# EAGLE design prometeo_001 (EAGLE 7.6.0)
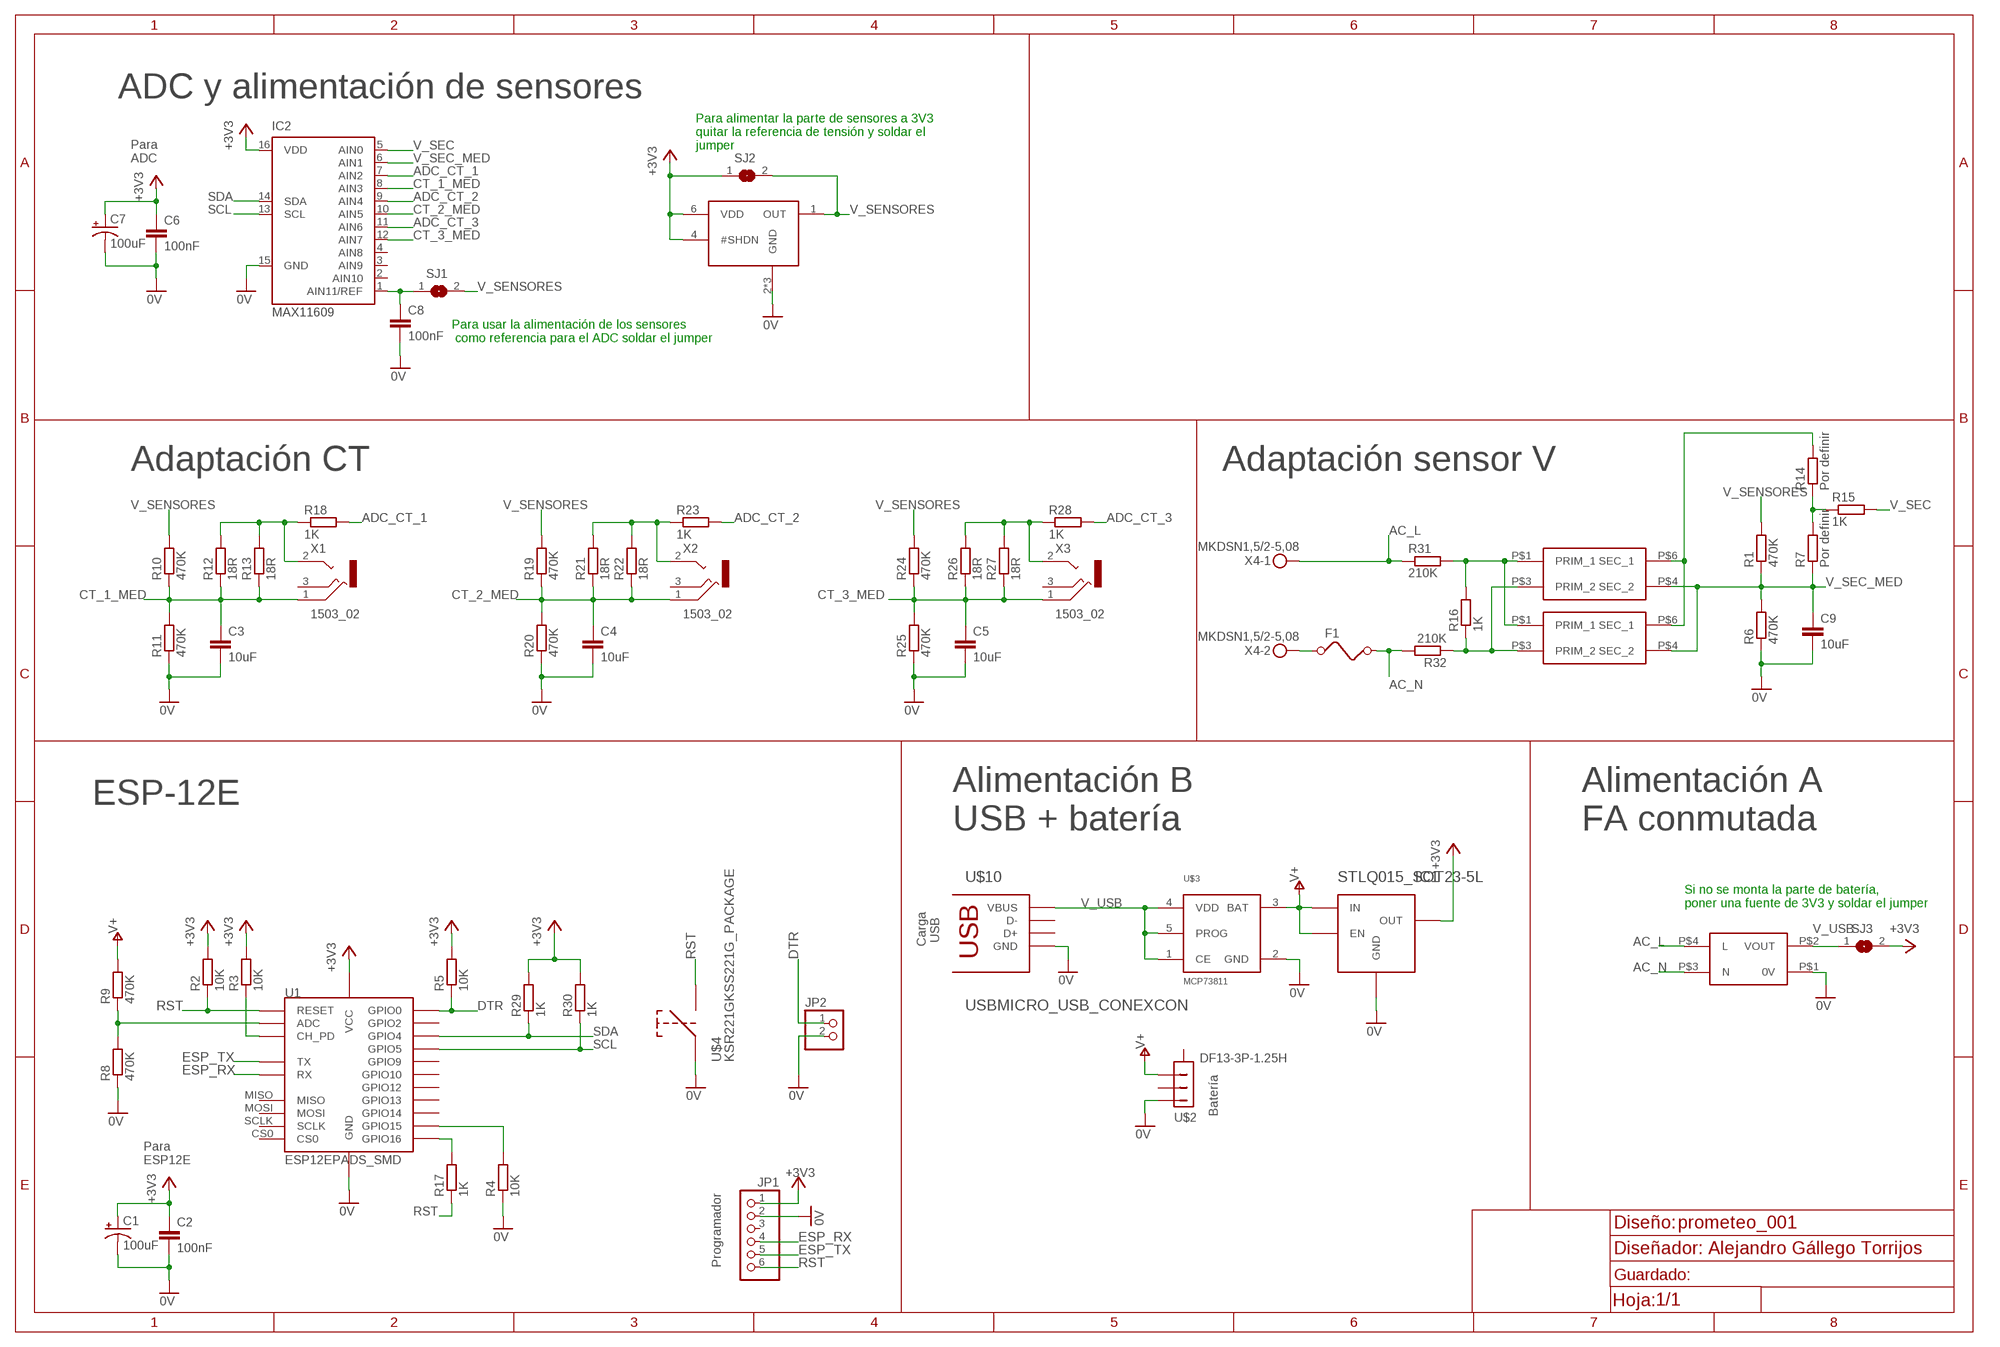
[diagram p0: schematic, sheet 1]

## Parts
C1  100uF  CPOL-USSMCC  [SMC_C]
C2  100nF  C-EUC0402  [C0402]
C3  10uF  C-EUC0805  [C0805]
C4  10uF  C-EUC0805  [C0805]
C5  10uF  C-EUC0805  [C0805]
C6  100nF  C-EUC0402  [C0402]
C7  100uF  CPOL-USSMCC  [SMC_C]
C8  100nF  C-EUC0402  [C0402]
C9  10uF  C-EUC0805  [C0805]
F1  FUSE  [FUSE]
IC1  STLQ015_SOT23-5L  [SOT23-5L]
IC2  MAX11609  [QSOP16]
JP1  PINHD-1X06_2.00  [1X06M]
JP2  PINHD-1X2  [1X02]
R1  470K  R-EU_R0402  [R0402]
R2  10K  R-EU_R0402  [R0402]
R3  10K  R-EU_R0402  [R0402]
R4  10K  R-EU_R0402  [R0402]
R5  10K  R-EU_R0402  [R0402]
R6  470K  R-EU_R0402  [R0402]
R7  Por definir  R-EU_R0402  [R0402]
R8  470K  R-EU_R0402  [R0402]
R9  470K  R-EU_R0402  [R0402]
R10  470K  R-EU_R0402  [R0402]
R11  470K  R-EU_R0402  [R0402]
R12  18R  R-EU_R1206  [R1206]
R13  18R  R-EU_0204/7  [0204/7]
R14  Por definir  R-EU_R0402  [R0402]
R15  1K  R-EU_R0402  [R0402]
R16  1K  R-EU_R1206  [R1206]
R17  1K  R-EU_R0402  [R0402]
R18  1K  R-EU_R0402  [R0402]
R19  470K  R-EU_R0402  [R0402]
R20  470K  R-EU_R0402  [R0402]
R21  18R  R-EU_R1206  [R1206]
R22  18R  R-EU_0204/7  [0204/7]
R23  1K  R-EU_R0402  [R0402]
R24  470K  R-EU_R0402  [R0402]
R25  470K  R-EU_R0402  [R0402]
R26  18R  R-EU_R1206  [R1206]
R27  18R  R-EU_0204/7  [0204/7]
R28  1K  R-EU_R0402  [R0402]
R29  1K  R-EU_R0402  [R0402]
R30  1K  R-EU_R0402  [R0402]
R31  210K  R-EU_R1206  [R1206]
R32  210K  R-EU_R1206  [R1206]
SJ1  SJ  [SJ]
SJ2  SJ  [SJ]
SJ3  SJ  [SJ]
U1  ESP12EPADS_SMD  [ESP12E_SMD]
U$1  MCP1501  [SOT23-6]
U$2  DF13-3P-1.25H  [DF13A-3P-1.25H]
U$3  MCP73811  [SOT23-5L]
U$4  KSR221GKSS221G_PACKAGE  [SMD1]
U$5  PSU_VTX  [PSU_VTX]
U$6  TRAFO_AISLAMIENTOBOURNS_SM-LP-5001  [SM-LP-5001]
U$7  TRAFO_AISLAMIENTOETAL_P3191  [P3191]
U$10  USBMICRO_USB_CONEXCON  [MICROUSB_CONEXCON_5632]
X1  1503_02  [1503_02]
X2  1503_02  [1503_02]
X3  1503_02  [1503_02]
X4  MKDSN1,5/2-5,08  [MKDSN1,5/2-5,08]

## Nets
0V: C1.- C2.2 C3.2 C4.2 C5.2 C6.2 C7.- C8.2 C9.2 IC1.2(GND) IC2.15(GND) JP1.2 JP2.2 R4.1 R6.1 R8.1 R11.1 R20.1 R25.1 U1.GND U$1.2(GND) U$1.3(GND) U$1.5(GND) U$2.P$1 U$3.2(GND) U$4.P$1 U$5.P$1(0V) U$10.GND U$10.GND1(GND) U$10.GND2(GND) U$10.P$8(GND) U$10.P$9(GND)
+3V3: C1.+ C2.1 C6.1 C7.+ IC1.5(OUT) IC2.16(VDD) JP1.1 R2.2 R3.2 R5.2 R29.2 R30.2 SJ2.1 SJ3.2 U1.VCC U$1.4(#SHDN) U$1.6(VDD)
AC_L: R31.1 U$5.P$4(L) X4.1
AC_N: F1.2 R32.2 U$5.P$3(N)
ADC_CT_1: IC2.7(AIN2) R18.2
ADC_CT_2: IC2.9(AIN4) R23.2
ADC_CT_3: IC2.11(AIN6) R28.2
CT_1_MED: C3.1 IC2.8(AIN3) R10.1 R11.2 R12.1 R13.1 X1.1
CT_2_MED: C4.1 IC2.10(AIN5) R19.1 R20.2 R21.1 R22.1 X2.1
CT_3_MED: C5.1 IC2.12(AIN7) R24.1 R25.2 R26.1 R27.1 X3.1
DTR: JP2.1 R5.1 U1.GPIO0
ESP_RX: JP1.4 U1.RXD(RX)
ESP_TX: JP1.5 U1.TXD(TX)
N$1: R4.2 U1.GPIO15
N$2: R16.2 R31.2 U$6.P$1(PRIM_1) U$7.P$1(PRIM_1)
N$3: R3.1 U1.CH-PD(CH_PD)
N$4: R16.1 R32.1 U$6.P$3(PRIM_2) U$7.P$3(PRIM_2)
N$5: R14.2 U$6.P$6(SEC_1) U$7.P$6(SEC_1)
N$6: F1.1 X4.2
N$7: R7.2 R14.1 R15.1
N$10: R8.2 R9.1 U1.ADC
N$13: R12.2 R13.2 R18.1 X1.2
N$16: R17.2 U1.GPIO16
N$18: R21.2 R22.2 R23.1 X2.2
N$21: R26.2 R27.2 R28.1 X3.2
N$25: C8.1 IC2.1(AIN11/REF) SJ1.1
RST: JP1.6 R2.1 R17.1 U1.RST(RESET) U$4.P$2
SCL: IC2.13(SCL) R30.1 U1.GPIO5
SDA: IC2.14(SDA) R29.1 U1.GPIO4
V+: IC1.1(IN) IC1.3(EN) R9.2 U$2.P$3 U$3.3(BAT)
V_SEC: IC2.5(AIN0) R15.2
V_SEC_MED: C9.1 IC2.6(AIN1) R1.1 R6.2 R7.1 U$6.P$4(SEC_2) U$7.P$4(SEC_2)
V_SENSORES: R1.2 R10.2 R19.2 R24.2 SJ1.2 SJ2.2 U$1.1(OUT)
V_USB: SJ3.1 U$3.1(CE) U$3.4(VDD) U$3.5(PROG) U$5.P$2(VOUT) U$10.VBUS
Unconnected: IC2.2(AIN10) IC2.3(AIN9) IC2.4(AIN8) JP1.3 U1.CS0 U1.GPIO2 U1.GPIO9 U1.GPIO10 U1.GPIO12 U1.GPIO13 U1.GPIO14 U1.MISO U1.MOSI U1.SCLK U$2.M$0 U$2.M$1 U$2.P$2 U$10.D+ U$10.D- X1.2@2 X1.3 X2.2@2 X2.3 X3.2@2 X3.3

## Notes on the sheet
- ADC y alimentación de sensores
- Para alimentar la parte de sensores a 3V3 
  quitar la referencia de tensión y soldar el 
  jumper
- Para 
  ADC
- Para usar la alimentación de los sensores
   como referencia para el ADC soldar el jumper
- Adaptación CT | Adaptación sensor V
- ESP-12E
- Alimentación B
  USB + batería
- Alimentación A
  FA conmutada
- Si no se monta la parte de batería,
  poner una fuente de 3V3 y soldar el jumper
- Carga
   USB
- Batería
- Para 
  ESP12E
- Diseñador: Alejandro Gállego Torrijos
- Programador

## Library data of the parts
C1 C7 = rcl:CPOL-US: POLARIZED CAPACITOR, American symbol
C2-C6 C8 C9 = rcl:C-EU: CAPACITOR, European symbol
F1 = special:FUSE: FUSE 5 x 20 mm
IC1 = libelium:STLQ015: ST => STLQ015XG33R
IC2 = libelium:MAX11609: 2.7V to 5.5V, Low-Power, 4-/12-Channel 2-Wire Serial 8-Bit ADCs Source: http://datasheets.maxim-ic.com/en/ds/MAX1036-MAX1039M.pdf
JP1 = pinhead-2:PINHD-1X06: PIN HEADER
JP2 = pinhead:PINHD-1X2: PIN HEADER
R1-R32 = rcl:R-EU_: RESISTOR, European symbol
SJ1-SJ3 = jumper:SJ: SMD solder JUMPER
U1 = esp8266modules:ESP12E
U$1 = libelium:MCP1501
U$2 = libelium:DF13-3P-1.25: DF13-3P 1.25mm Pitch Miniature Crimping Connector.; MF: Hirose; MPN: DF13-3P-1.25H
U$3 = libelium:MCP73811
U$4 = libelium:KSR221G; MF: C&K Components; MPN: KSR221G LFS; OC_FARNELL: 1201421
U$5 = libelium:PSU_VTX
U$6 U$7 = libelium:TRAFO_AISLAMIENTO
U$10 = libelium:USB: Conexcon => 5632-16052E; MF: Conexcon; MPN: 5632-16052E
X1-X3 = con-lumberg:1503_02: Jack connectors according to JISC 6560, 3.5 mm Klinkeneinbaukupplung nach JISC 6560, 3,5 mm, 3-polig/stereo, abgewinkelte Ausführung, Surface-Mount-Technik (SMT) Source: http://www.lumberg.com/Produkte/PDFs/1503_02.pdf; OC_FARNELL: 1216979; OC_NEWARK: unknown
X4 = con-phoenix-508:MKDSN1,5/2-5,08: MKDSN 1,5/ 2-5,08 Printklemme Nennstrom: 13,5 A Nennspannung: 250 V Rastermaß: 5,08 mm Polzahl: 2 Anschlussart: Schraubanschluss Montage: Löten Anschlussrichtung Leiter/Platine: 0 ° Artikelnummer: 1729128 Source: http://eshop.phoenixcontact.com .. 1729128.pdf

## Board
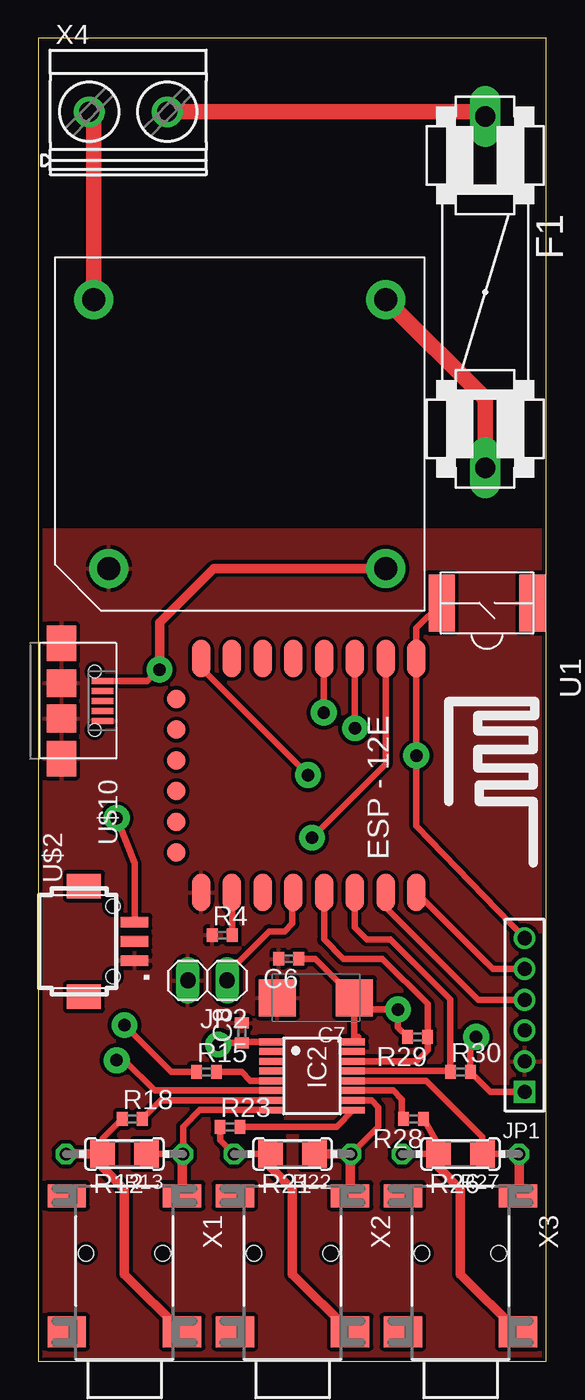
[diagram p1: board, top side]
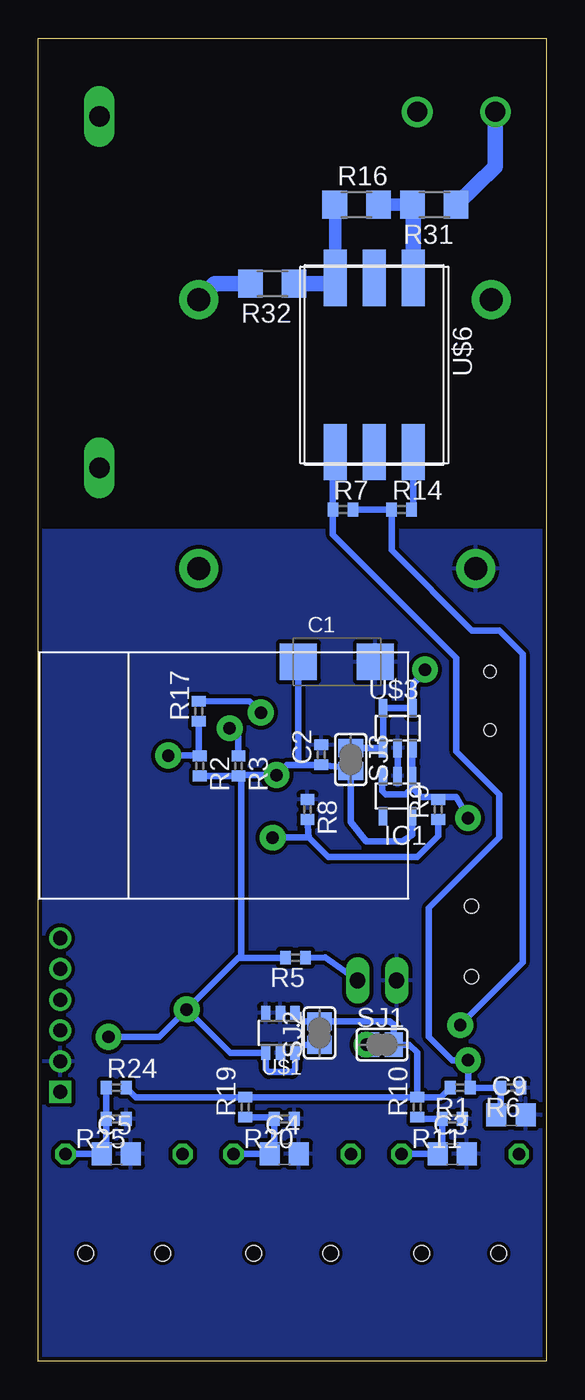
[diagram p2: board, bottom side, seen from below]

Size 33 x 86 mm. Coordinates in mm from the lower left corner, seen from the top.
Outline: 0,0 33,0 33,86 0,86 0,0
Copper layers (1*16): Top 0.035mm / dielectric 1.5mm / Bottom 0.035mm
Design rules "SeeedStudio_2layer_DRU_no_angle_20140221": minimum track width 6mil, minimum drill 12mil, track to track 6mil, track to pad 6mil, pad to pad 6mil, via to via 6mil, smd to smd 0mil, copper to edge 10mil, drill to drill 10mil, minimum pad ring 10mil, minimum via ring 6mil, stop-mask expansion 2mil, vias tented up to drill 100mil, thermal gap 10mil

### Footprints (pad centres in the part's own frame; a part is rotated, then mirrored left to right if it is on the bottom)
SMC_C = smd 2.4 x 2.4: + -2.5,0; - 2.5,0
C0402 = smd 0.7 x 0.9: 1 -0.65,0; 2 0.65,0
C0805 = smd 1.3 x 1.5: 1 -0.95,0; 2 0.95,0
FUSE = drill 1.321 long: 1 -11.43,0; 2 11.43,0
SOT23-5L = smd 0.55 x 1.2: 1 -0.95,-1.3; 2 0,-1.3; 3 0.95,-1.3; 4 0.95,1.3; 5 -0.95,1.3
QSOP16 = smd 0.45 x 1.5: 1 -2.223,-2.69; 2 -1.587,-2.69; 3 -0.953,-2.69; 4 -0.318,-2.69; 5 0.318,-2.69; 6 0.953,-2.69; 7 1.587,-2.69; 8 2.223,-2.69; 9 2.223,2.69; 10 1.587,2.69; 11 0.953,2.69; 12 0.318,2.69; 13 -0.318,2.69; 14 -0.953,2.69; 15 -1.587,2.69; 16 -2.223,2.69
1X06M = drill 0.914 square: 1 -5,0 | drill 0.914: 2 -3,0; 3 -1,0; 4 1,0; 5 3,0; 6 5,0
1X02 = drill 1.016 long: 1 -1.27,0; 2 1.27,0
R0402 = smd 0.7 x 0.9: 1 -0.65,0; 2 0.65,0
R1206 = smd 1.6 x 1.803: 1 -1.422,0; 2 1.422,0
0204/7 = drill 0.813 octagon: 1 -3.81,0; 2 3.81,0
SJ = smd 1.168 x 1.6: 1 -0.762,0; 2 0.762,0
ESP12E_SMD = smd 2.413 x 1.194: ADC -7.239,4.706; CH-PD -7.239,2.706; GND 7.976,-7.294; GPIO0 7.976,-1.294; GPIO2 7.976,-3.294; GPIO4 7.976,0.706; GPIO5 7.976,2.706; GPIO12 -7.239,-3.294; GPIO13 -7.239,-5.294; GPIO14 -7.239,-1.294; GPIO15 7.976,-5.294; GPIO16 -7.239,0.706; RST -7.239,6.706; RXD 7.976,4.706; TXD 7.976,6.706; VCC -7.239,-7.294 | smd 1.194 x 1.194: CS0 -4.615,-8.89; GPIO9 -0.615,-8.89; GPIO10 1.385,-8.89; MISO -2.615,-8.89; MOSI 3.385,-8.89; SCLK 5.385,-8.89
SOT23-6 = smd 0.6 x 0.9: 1 -0.95,-1.3; 2 0,-1.3; 3 0.95,-1.3; 4 0.95,1.3; 5 0,1.3; 6 -0.95,1.3
DF13A-3P-1.25H = smd 1.6 x 2.2: M$0 -3.6,2.4; M$1 3.6,2.4 | smd 0.7 x 1.8: P$1 -1.25,-0.9; P$2 0,-0.9; P$3 1.25,-0.9 | hole 0.9: 2.3,0.5; -2.3,0.5
SMD1 = smd 1.7 x 3.7: P$1 2.95,0; P$2 -2.95,0
PSU_VTX = drill 1.5 pad 2.54: P$1 8.75,-8.5; P$2 8.75,9.5; P$3 -8.75,9.5; P$4 -8.75,-9.5
SM-LP-5001 = smd 2.5 x 1.5: P$1 -6.25,2.54; P$2 -6.25,0; P$3 -6.25,-2.54; P$4 6.25,-2.54; P$5 6.25,0; P$6 6.25,2.54
P3191 = smd 2.5 x 1.5: P$1 -5.08,2.54; P$2 -5.08,0; P$3 -5.08,-2.54; P$4 5.08,-2.54; P$5 5.08,0; P$6 5.08,2.54
MICROUSB_CONEXCON_5632 = smd 0.4 x 1.4: D+ 0,4.1; D- -0.65,4.1; GND 1.3,4.1; P$6 0.65,4.1; VBUS -1.3,4.1 | smd 2.3 x 1.9: GND1 -3.75,1.45; GND2 3.75,1.45 | smd 1.8 x 1.9: P$8 -1.15,1.45; P$9 1.15,1.45 | hole 0.8: -1.9,3.6; 1.9,3.6
1503_02 = smd 2.5 x 1.5: 1 -3.75,-10.75; 3 3.75,-10.75 | smd 2.5 x 2: 2 -3.75,-1.9; 2@2 3.75,-1.9 | hole 1: -2.5,-7; 2.5,-7
MKDSN1,5/2-5,08 = drill 1.3 pad 2: 1 -2.561,0.025; 2 2.519,0.025

### Placement (x,y rotation side)
C1  13.6,45.47 0 bottom
C2  14.63,39.42 90 bottom
C3  6.1,13.46 0 bottom
C4  17.02,13.46 0 bottom
C5  27.94,13.46 0 bottom
C6  16.27,26.16 180 top
C7  18.03,23.62 180 top
C8  13.21,21.34 90 top
C9  2.29,16 0 bottom
F1  29.04,69.5 270 top
IC1  9.66,36.74 180 bottom
IC2  17.78,18.54 270 top
JP1  31.6,22.5 90 top
JP2  10.99,24.75 180 top
R1  5.59,17.78 180 bottom
R2  22.51,38.7 270 bottom
R3  20,38.7 270 bottom
R4  11.94,27.69 0 top
R5  16.29,26.23 180 bottom
R6  2.29,17.78 180 bottom
R7  13.21,55.37 0 bottom
R8  15.52,35.86 270 bottom
R9  7.01,35.86 90 bottom
R10  8.38,16.51 90 bottom
R11  6.1,15.75 180 bottom
R12  5.59,13.46 180 top
R13  5.59,13.46 180 top
R14  9.4,55.37 0 bottom
R15  10.92,18.8 0 top
R16  12.32,75.18 0 bottom
R17  22.57,42.25 90 bottom
R18  6.1,15.75 0 top
R19  19.56,16.51 90 bottom
R20  17.02,15.75 180 bottom
R21  16.51,13.46 180 top
R22  16.51,13.46 180 top
R23  12.45,15.24 0 top
R24  27.94,17.78 0 bottom
R25  27.94,15.75 180 bottom
R26  27.43,13.46 180 top
R27  27.43,13.46 180 top
R28  24.38,15.75 180 top
R29  24.64,21.08 180 top
R30  27.43,18.8 0 top
R31  7.27,75.18 180 bottom
R32  17.81,70.06 180 bottom
SJ1  10.67,20.57 0 bottom
SJ2  14.73,21.34 90 bottom
SJ3  12.7,39.12 270 bottom
U1  17.86,38.44 270 top
U$1  17.27,21.34 180 bottom
U$2  5.35,27.29 90 top
U$3  9.65,41.15 0 bottom
U$4  29.15,49.3 0 top
U$5  13.08,60.28 270 top
U$6  11.18,64.77 270 bottom
U$7  11.18,64.77 270 bottom
U$10  0.05,42.93 270 top
X1  5.59,0 180 top
X2  16.51,0 180 top
X3  27.43,0 180 top
X4  5.86,81.2 0 top

### Tracks (layer width: path | path; a pad name or v marks a point on that pad's centre or on a via)
0V
  Bottom 0.406: U$3.2 IC1.2
  pour Bottom (isolate 0.254): 0,0 33,0 33,54 0,54
  pour Top (isolate 0.254): 0,0 33,0 33,54 0,54
+3V3  (via drill 0.8 pad 1.68)
  Top 0.406: C7.+ 20.53,20.83 IC2.16 20.79,21.08 | C7.+ 21.08,22.86 v23.37,22.86 23.37,21.7 R29.2 | v28.45,21.08 28.08,20.72 R30.2 29.38,17.5 JP1.1 | C6.1 17.99,26.16 C7.+ | U1.VCC 10.57,45.06 v17.53,38.1
  Bottom 0.406: SJ2.1 15.78,20.57 U$1.6 16.32,18.98 16.51,18.8 18.03,18.8 18.22,18.98 U$1.4 20.54,20.04 v23.37,22.86 | v28.45,21.08 25.15,21.08 v23.37,22.86 | R5.2 19.81,26.23 | 19.81,26.23 20,26.23 v23.37,22.86 | R2.2 R3.2 | R3.2 19.81,37.86 19.81,26.23 | v17.53,38.1 19.95,38.1 R3.2 | IC1.5 8.71,34.22 9.4,33.78 11.68,33.78 12.7,35.05 SJ3.2 13.19,38.61 C2.1 16,38.77 | 17.02,38.61 v17.53,38.1 | 16,38.77 16.86,38.77 v17.53,38.1 | C1.+ 16.1,38.87 16,38.77
AC_L
  Top 1.016: X4.1 3.58,81.22 U$5.P$4
  Bottom 1.016: R31.1 3.3,77.67 X4.1
AC_N
  Top 1.016: F1.2 29.04,62.57 U$5.P$3
  Bottom 1.016: R32.2 21.55,70.06 U$5.P$3
ADC_CT_1
  Top 0.406: IC2.7 7.95,16.95 R18.2
ADC_CT_2
  Top 0.406: R23.2 19.39,15.24 IC2.9
ADC_CT_3
  Top 0.406: IC2.11 23.05,17.59 23.62,17.02 23.62,15.86 R28.2
CT_1_MED
  Top 0.406: R12.1 R13.1 9.4,15.24 10.48,16.32 IC2.8
  Top 0.61: R13.1 9.34,13.46 X1.1
  Bottom 0.406: R13.1 C3.1 6.75,13.76 R11.2 8.27,15.75 R10.1
CT_2_MED
  Top 0.406: IC2.10 21.65,16.95 22.1,16.51 22.1,15.24 R22.1
  Top 0.61: R21.1 R22.1 20.26,13.4 X2.1
  Bottom 0.406: R22.1 C4.1 17.67,13.76 R20.2 17.78,15.86 R19.1
CT_3_MED
  Top 0.406: R27.1 R26.1 28.85,14.58 25.21,18.22 IC2.12
  Top 0.61: R27.1 31.24,10.81 X3.1
  Bottom 0.406: R24.1 R25.2 28.59,13.76 C5.1 R27.1
DTR
  Top 0.406: 16.57,30.63 U1.GPIO0 16.51,30.41 16.51,28.45 16,27.94 14.99,27.94 12.26,25.21 JP2.1
  Bottom 0.406: R5.1 14.36,26.24 JP2.1
ESP_RX
  Top 0.406: U1.RXD 22.57,29.5 28.57,23.5 JP1.4
ESP_TX
  Top 0.406: U1.TXD 29.54,25.5 JP1.5
N$1
  Top 0.406: R4.2 12.59,30.44 U1.GPIO15
N$2
  Bottom 0.813: R31.2 R16.2
  Bottom 1.016: R31.2 8.64,75.06 U$6.P$1 U$7.P$1
N$3  (via drill 0.8 pad 1.68)
  Top 0.406: U1.CH-PD v20.57,41.15
  Bottom 0.406: v20.57,41.15 20,40.57 R3.1
N$4
  Bottom 0.813: R16.1 13.72,75.18 U$7.P$3
  Bottom 1.016: R32.1 13.92,70.06 U$7.P$3 U$6.P$3
N$5
  Bottom 0.406: U$6.P$6 8.64,55.48 R14.2
  Bottom 1.016: U$7.P$6 U$6.P$6
N$6
  Top 1.016: X4.2 29.04,81.22 F1.1
N$7  (via drill 0.8 pad 1.68)
  Top 0.406: R15.1 8.64,18.8 v5.59,21.84
  Bottom 0.406: R7.2 R14.1 10.05,52.72 4.83,47.5 3.05,47.5 1.52,45.97 1.52,25.91 v5.59,21.84
N$10  (via drill 0.8 pad 1.68)
  Top 0.406: U1.ADC 22.57,38.82 v17.78,34.04
  Bottom 0.406: v17.78,34.04 15.42,34.04 | 15.42,34.04 R8.2 | R9.1 7.01,34.14 8.38,32.77 14.15,32.77 15.42,34.04
N$13
  Top 0.406: R12.2 4.17,14.47 R18.1
  Top 0.61: R13.2 R12.2 4.17,12.6 5.59,11.18 5.59,5.65 X1.2
N$16  (via drill 0.8 pad 1.68)
  Top 0.406: U1.GPIO16 18.54,45.66 v18.54,42.16
  Bottom 0.406: v18.54,42.16 19.27,42.89 R17.2
N$18
  Top 0.406: R21.2 R22.2 11.83,14.34 R23.1
  Top 0.61: R21.2 15.09,12.6 16.51,11.18 16.51,5.65 X2.2
N$21
  Top 0.406: R27.2 R26.2 26.01,14.01 R28.1
  Top 0.61: R26.2 26.01,12.6 27.43,11.18 27.43,5.65 X3.2
N$25  (via drill 0.8 pad 1.68)
  Top 0.406: IC2.1 13.29,20.77 C8.1 12.3,20.69 v11.68,20.57
  Bottom 0.406: v11.68,20.57 SJ1.1
RST  (via drill 0.8 pad 1.68)
  Top 0.406: JP1.6 24.57,34.78 v24.57,39.37 U1.RST 24.57,47.66 U$4.P$2
  Bottom 0.406: v24.57,39.37 22.53,39.37 R2.1 22.57,39.41 R17.1
SCL
  Top 0.406: IC2.13 26.72,18.86 R30.1 26.78,23.51 22.86,27.43 21.34,27.43 20.57,28.2 U1.GPIO5
SDA
  Top 0.406: U1.GPIO4 18.57,27.41 19.81,26.16 22.35,26.16 25.29,23.23 R29.1 25.29,20.21 24.57,19.49 IC2.14
V+  (via drill 0.8 pad 1.68)
  Top 0.406: U$2.P$3 6.25,32.36 v5.08,35.31
  Bottom 0.406: U$3.3 IC1.1 8.71,37.26 | 8.71,37.26 9.14,36.83 10.41,36.83 10.67,37.08 10.67,37.98 IC1.3 | R9.2 6.86,36.68 | 6.86,36.68 8.13,36.68 8.71,37.26 | v5.08,35.31 5.84,36.68 6.86,36.68
V_SEC
  Top 0.406: IC2.5 13.78,18.22 13.21,18.8 R15.2
V_SEC_MED  (via drill 0.8 pad 1.68)
  Top 0.406: IC2.6 7.56,17.59 5.59,19.56 v5.08,19.56
  Bottom 0.406: U$6.P$4 13.86,58.38 R7.1 13.86,53.74 5.84,45.72 5.84,39.62 3.05,36.83 3.05,34.04 7.62,29.46 7.62,21.08 6.1,19.56 v5.08,19.56 5.08,17.67 R1.1 R6.2 2.94,16.3 C9.1
  Bottom 1.016: U$7.P$4 U$6.P$4
V_SENSORES
  Bottom 0.406: R10.2 R19.2 26.67,17.16 R24.2 | U$1.1 15.78,22.1 SJ2.2 10.16,22.1 9.91,21.84 SJ1.2 8.89,20.57 8.38,20.07 R10.2 | R1.2 6.86,17.16 R10.2
V_USB  (via drill 0.8 pad 1.68)
  Top 0.406: U$10.VBUS 7.08,44.23 v7.87,44.96
  Top 0.61: U$5.P$2 11.4,51.53 7.87,48.01 v7.87,44.96
  Bottom 0.406: v7.87,44.96 8.64,44.04 U$3.4 U$3.5 U$3.1 12.67,39.85 SJ3.1